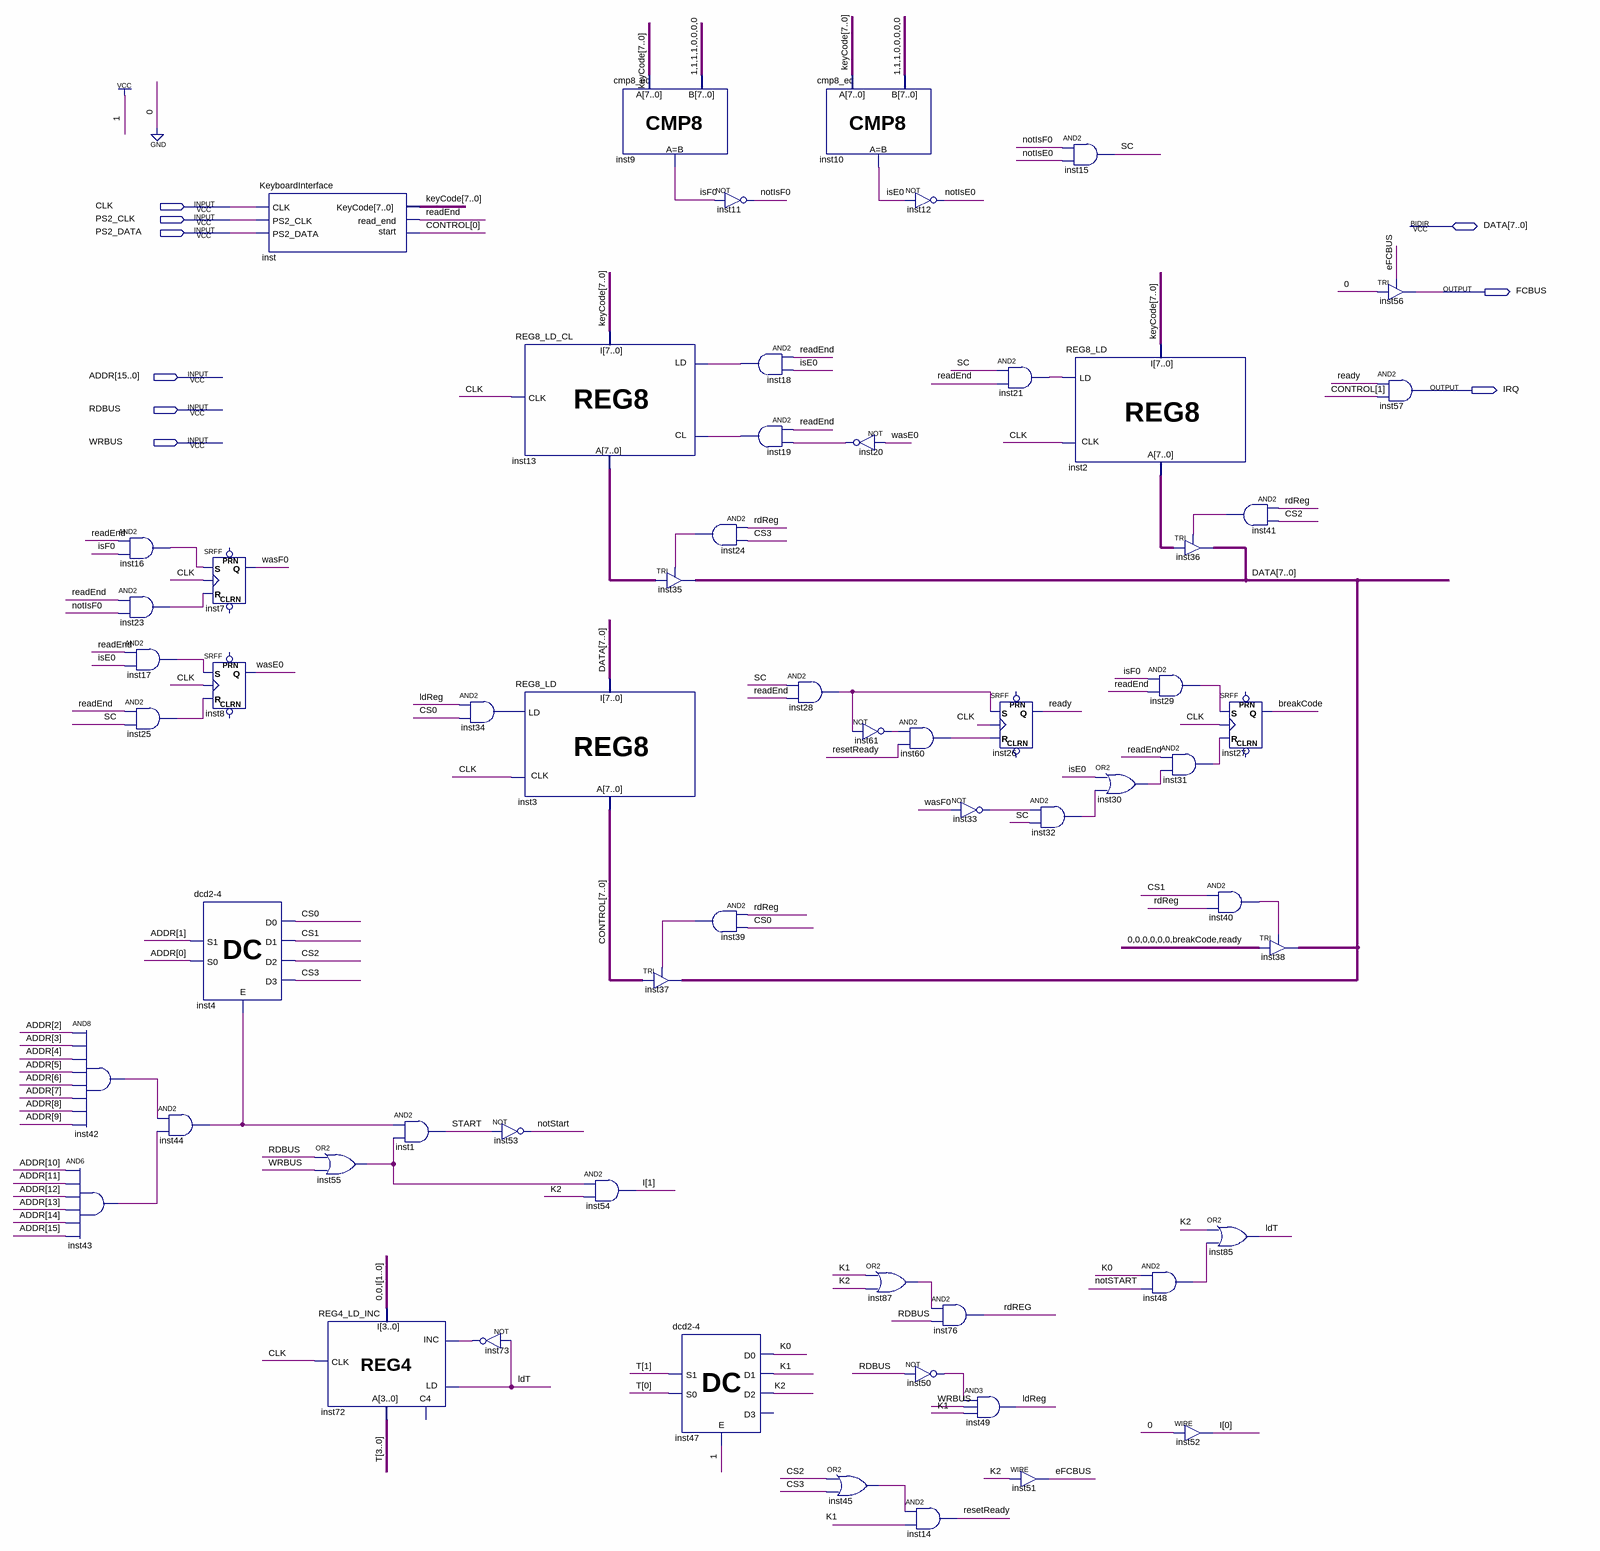
[diagram p0: schematic sheet]
// Quartus schematic PS2_Controller.bdf as structural Verilog: 61 symbols, 9 pins
module PS2_Controller (
  input  CLK,
  input  PS2_CLK,
  input  PS2_DATA,
  input  [15:0] ADDR,
  input  RDBUS,
  input  WRBUS,
  inout  [7:0] DATA,
  output FCBUS,
  output IRQ
);

  wire breakCode, CS0, CS1, CS2, CS3, eFCBUS, inst16_out, inst17_out, inst18_out, inst19_out, inst20_out,
       inst21_out, inst23_out, inst24_out, inst25_out, inst28_out, inst29_out, inst30_out, inst31_out,
       inst32_out, inst33_out, inst34_out, inst39_out, inst40_out, inst41_out, inst42_out, inst43_out,
       inst44_out, inst45_out, inst48_out, inst50_out, inst55_out, inst60_out, inst61_out, inst73_out,
       inst87_out, isE0, isF0, K0, K1, K2, ldReg, ldT, notIsE0, notIsF0, notSTART, rdReg, readEnd, ready,
       resetReady, SC, START, wasE0, wasF0;
  wire [1:0] I;
  wire [3:0] T;
  wire [7:0] CONTROL, inst2_a, inst13_a, keyCode;

  and inst42 (inst42_out, ADDR[2], ADDR[3], ADDR[4], ADDR[5], ADDR[6], ADDR[7], ADDR[8], ADDR[9]);
  and inst43 (inst43_out, ADDR[10], ADDR[11], ADDR[12], ADDR[13], ADDR[14], ADDR[15]);
  and inst16 (inst16_out, readEnd, isF0);
  and inst23 (inst23_out, readEnd, notIsF0);
  and inst17 (inst17_out, readEnd, isE0);
  and inst25 (inst25_out, readEnd, SC);
  and inst44 (inst44_out, inst42_out, inst43_out);
  SRFF inst7 (.S(inst16_out), .R(inst23_out), .CLK(CLK), .Q(wasF0));  // open: PRN, CLRN
  SRFF inst8 (.S(inst17_out), .R(inst25_out), .CLK(CLK), .Q(wasE0));  // open: PRN, CLRN
  \dcd2-4  inst4 (.E(inst44_out), .S1(ADDR[1]), .S0(ADDR[0]), .D0(CS0), .D1(CS1), .D2(CS2), .D3(CS3));
  KeyboardInterface inst (
    .start(CONTROL[0]), .CLK(CLK), .PS2_CLK(PS2_CLK), .PS2_DATA(PS2_DATA), .KeyCode(keyCode),
    .read_end(readEnd));
  or inst55 (inst55_out, RDBUS, WRBUS);
  REG4_LD_INC inst72 (.LD(ldT), .INC(inst73_out), .CLK(CLK), .I({2'b00, I}), .A(T));  // open: C4
  and inst1 (START, inst44_out, inst55_out);
  and inst34 (inst34_out, ldReg, CS0);
  not inst53 (notSTART, START);
  not inst73 (inst73_out, ldT);
  REG8_LD_CL inst13 (.I(keyCode), .CLK(CLK), .LD(inst18_out), .CL(inst19_out), .A(inst13_a));
  REG8_LD inst3 (.I(DATA), .CLK(CLK), .LD(inst34_out), .A(CONTROL));
  and inst54 (I[1], inst55_out, K2);
  cmp8_eq inst9 (.A(keyCode), .B(8'b11110000), .eq(isF0));
  TRI inst37[7:0] (.IN(CONTROL), .OE(inst39_out), .OUT(DATA));
  and inst24 (inst24_out, rdReg, CS3);
  TRI inst35[7:0] (.IN(inst13_a), .OE(inst24_out), .OUT(DATA));
  and inst39 (inst39_out, rdReg, CS0);
  \dcd2-4  inst47 (.E(1'b1), .S1(T[1]), .S0(T[0]), .D0(K0), .D1(K1), .D2(K2));  // open: D3
  not inst11 (notIsF0, isF0);
  and inst18 (inst18_out, readEnd, isE0);
  and inst19 (inst19_out, readEnd, inst20_out);
  and inst28 (inst28_out, SC, readEnd);
  cmp8_eq inst10 (.A(keyCode), .B(8'b11100000), .eq(isE0));
  not inst20 (inst20_out, wasE0);
  not inst61 (inst61_out, inst28_out);
  or inst45 (inst45_out, CS2, CS3);
  not inst12 (notIsE0, isE0);
  and inst60 (inst60_out, inst61_out, resetReady);
  or inst87 (inst87_out, K1, K2);
  not inst50 (inst50_out, RDBUS);
  and inst14 (resetReady, inst45_out, K1);
  not inst33 (inst33_out, wasF0);
  and inst76 (rdReg, inst87_out, RDBUS);
  and inst49 (ldReg, inst50_out, WRBUS, K1);
  and inst21 (inst21_out, SC, readEnd);
  SRFF inst26 (.S(inst28_out), .R(inst60_out), .CLK(CLK), .Q(ready));  // open: PRN, CLRN
  assign eFCBUS = K2;  // WIRE inst51
  and inst15 (SC, notIsF0, notIsE0);
  REG8_LD inst2 (.I(keyCode), .CLK(CLK), .LD(inst21_out), .A(inst2_a));
  and inst32 (inst32_out, inst33_out, SC);
  or inst30 (inst30_out, isE0, inst32_out);
  TRI inst36[7:0] (.IN(inst2_a), .OE(inst41_out), .OUT(DATA));
  and inst29 (inst29_out, isF0, readEnd);
  and inst31 (inst31_out, readEnd, inst30_out);
  and inst48 (inst48_out, K0, notSTART);
  assign I[0] = 1'b0;  // WIRE inst52
  and inst41 (inst41_out, rdReg, CS2);
  SRFF inst27 (.S(inst29_out), .R(inst31_out), .CLK(CLK), .Q(breakCode));  // open: PRN, CLRN
  and inst40 (inst40_out, CS1, rdReg);
  or inst85 (ldT, K2, inst48_out);
  TRI inst38[7:0] (.IN({{6{1'b0}}, breakCode, ready}), .OE(inst40_out), .OUT(DATA));
  TRI inst56 (.IN(1'b0), .OE(eFCBUS), .OUT(FCBUS));
  and inst57 (IRQ, ready, CONTROL[1]);
endmodule
